# EAGLE design topboardcombined (EAGLE 9.6.2)
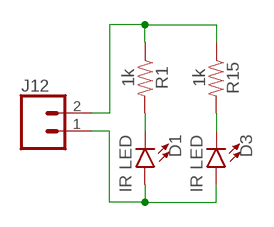
[diagram p0: schematic, sheet 1]

## Parts
D1  IR LED  LED-IR0603  [LED-0603]
D3  IR LED  LED-IR0603  [LED-0603]
J12  CONN_02  [1X02]
R1  1k  1KOHM-0603-1/10W-1%  [0603]
R15  1k  1KOHM-0603-1/10W-1%  [0603]

## Nets
N$44: J12.2 R1.1 R15.1
N$45: D1.C R1.2
N$46: D3.C R15.2
N$51: D1.A D3.A J12.1

## Library data of the parts
D1 D3 = SparkFun-LED:LED-IR: Infrared LED (IR) Wavelength: 940nm Packages: TSAL6100 LTE302 - Side firing. Check SparkFun-Sensors.lbr for the receiver SparkFun Products: ZX Distance and Gesture Sensor <[https://www.sparkfun.com/products/12780]> Infrared Emitters and Detectors <https://www.sparkfun.com/products/241>; PROD_ID: DIO-14125
J12 = SparkFun-Connectors:CONN_02: Multi connection point. Often used as Generic Header-pin footprint for 0.1 inch spaced/style header connections On any of the 0.1 inch spaced packages, you can populate with these: Break Away Headers - Straight <https://www.sparkfun.com/products/116> (PRT-00116) Break Away Male Headers - Right Angle <https://www.sparkfun.com/products/553> (PRT-00553) Female Headers <https://www.sparkfun.com/products/115> (PRT-00115) Break Away Headers - Machine Pin <https://www.sparkfun.com/products/117> (PRT-00117) Break Away Female Headers - Swiss Machine Pin <https://www.sparkfun.com/products/743> (PRT-00743) For SCREWTERMINALS and SPRING TERMINALS visit here: Screw Terimnals on SparkFun.com <https://www.sparkfun.com/search/results?term=Screw+Terminals> (5mm/3.5mm/2.54mm spacing) This device is also useful as a general connection point to wire up your design to another part of your project. Our various solder wires solder well into these plated through hole pads. Hook-Up Wire - Assortment (Stranded, 22 AWG) <https://www.sparkfun.com/products/11375> (PRT-11375) Hook-Up Wire - Assortment (Solid Core, 22 AWG) <https://www.sparkfun.com/products/11367> (PRT-11367) View the entire wire category on our website here <https://www.sparkfun.com/categories/141> Special notes: Molex polarized connector foot print use with: PRT-08233 with associated crimp pins and housings. 2.54_SCREWTERM for use with PRT-10571. 3.5mm Screw Terminal footprints for PRT-08084 5mm Screw Terminal footprints for use with PRT-08432
R1 R15 = SparkFun-Resistors:1KOHM: 1kΩ resistor A resistor is a passive two-terminal electrical component that implements electrical resistance as a circuit element. Resistors act to reduce current flow, and, at the same time, act to lower voltage levels within circuits. - Wikipedia; PROD_ID: RES-07856

## Board
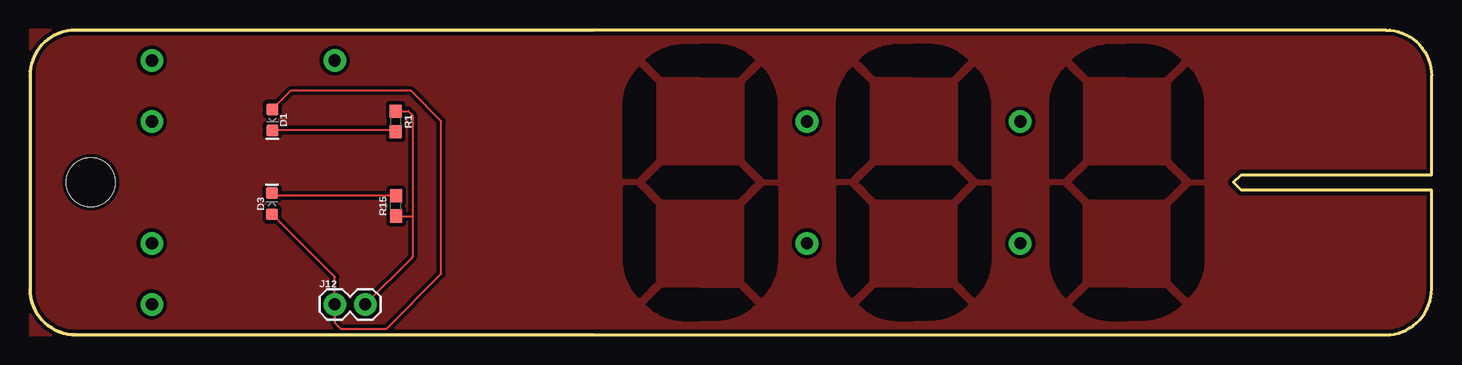
[diagram p1: board, top side]
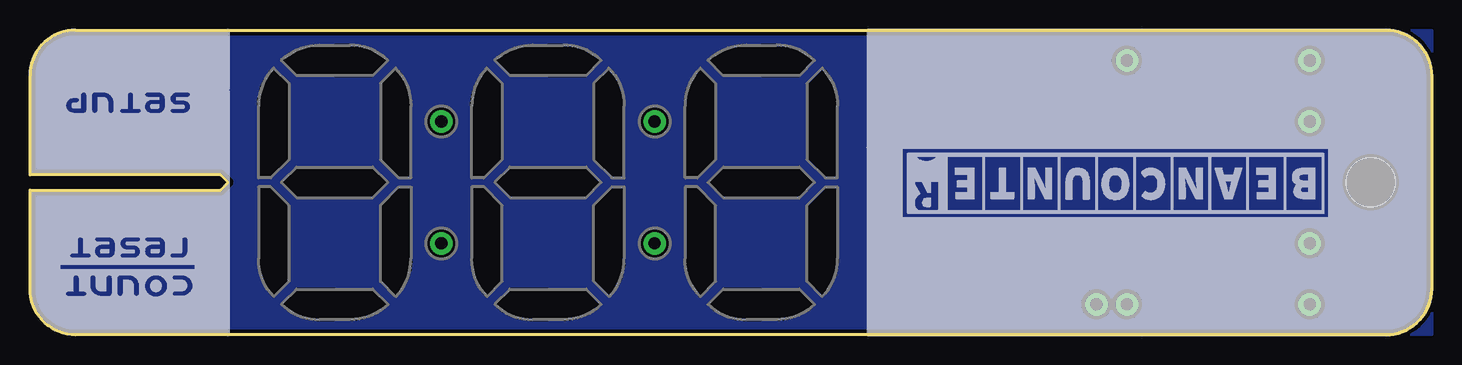
[diagram p2: board, bottom side, seen from below]

Size 116.84 x 25.4 mm. Coordinates in mm from the lower left corner, seen from the top.
Outline: 3.81,0 113.03,0 arc90 116.84,3.81 116.84,12.06 100.96,12.06 100.33,12.7 100.96,13.34 116.84,13.34 116.84,21.59 arc90 113.03,25.4 3.81,25.4
Outline: 3.81,0 arc-90 0,3.81
Outline: 3.81,25.4 arc90 0,21.59
Outline: 0,3.81 arc90 3.81,0
Outline: 24.13,0 46.99,0
Outline: 3.81,25.4 arc90 0,21.59
Outline: 0,21.59 0,3.81
Outline: 46.99,25.4 24.13,25.4
Copper layers (1*16): Top 0.035mm / dielectric 30mil / Bottom 0.035mm
Design rules "SparkFun-2-Layer-Minimum-JLCPCB *": minimum track width 5mil, minimum drill 0.3mm, track to track 5mil, track to pad 5mil, pad to pad 5mil, via to via 5mil, smd to smd 5mil, copper to edge 7mil, drill to drill 7mil, minimum pad ring 5mil, minimum via ring 5mil, stop-mask expansion 4mil, vias tented up to drill 25mil, thermal gap 10mil
Holes 4.06 mm at 5.08,12.7

### Footprints (pad centres in the part's own frame; a part is rotated, then mirrored left to right if it is on the bottom)
LED-0603 = smd 1 x 1: A -0.877,0; C 0.877,0
1X02 = drill 1.016 pad 1.88: 1 0,0; 2 2.54,0
0603 = smd 1.1 x 1: 1 -0.85,0; 2 0.85,0

### Placement (x,y rotation side)
D1  20.19,17.91 270 top
D3  20.18,10.92 90 top
J12  25.4,2.54 0 top
R1  30.48,17.78 270 top
R15  30.5,10.74 90 top
U$1  [#COUNT#0]  108.71,4.06 180 bottom
U$2  [#RESET#0]  108.71,7.24 180 bottom
U$3  [#SETUP#0]  108.71,19.3 180 bottom
U$4  [LOGO#SVG0]  8.89,15.24 180 bottom

### Tracks (layer width: path | path; a pad name or v marks a point on that pad's centre or on a via)
MASKBTM
  pour Top (isolate 0.305): 0,0 113.03,0 arc90 116.84,3.81 116.84,12.06 100.96,12.06 100.33,12.7 100.96,13.34 116.84,13.34 116.84,21.59 arc90 113.03,25.4 0,25.4
MASKTP
  pour Bottom (isolate 0.305): 0,0 113.03,0 arc90 116.84,3.81 116.84,12.06 100.96,12.06 100.33,12.7 100.96,13.34 116.84,13.34 116.84,21.59 arc90 113.03,25.4 0,25.4
N$1  (via drill 1.02 pad 1.88)
  other vias: 25.4,22.86
N$23  (via drill 1.02 pad 1.88)
  other vias: 27.94,2.54
N$24  (via drill 1.02 pad 1.88)
  other vias: 25.4,2.54
N$25  (via drill 1.02 pad 1.88)
  other vias: 25.4,22.86
N$26  (via drill 1.02 pad 1.88)
  other vias: 82.55,17.78
N$27  (via drill 1.02 pad 1.88)
  other vias: 82.55,7.62
N$28  (via drill 1.02 pad 1.88)
  other vias: 64.77,7.62
N$29  (via drill 1.02 pad 1.88)
  other vias: 64.77,17.78
N$37  (via drill 1.02 pad 1.88)
  other vias: 10.16,22.86
N$38  (via drill 1.02 pad 1.88)
  other vias: 10.16,2.54
N$39  (via drill 1.02 pad 1.88)
  other vias: 10.16,7.62
N$40  (via drill 1.02 pad 1.88)
  other vias: 10.16,17.78
N$43  (via drill 1.02 pad 1.88)
  other vias: 25.4,22.86
N$44
  Top 0.152: R1.1 31.53,18.63 31.88,18.29 31.88,9.91 | 31.88,9.91 31.88,6.48 J12.2 | R15.1 31.86,9.89 31.88,9.91
N$45
  Top 0.152: 30.38,17.03 D1.C
  Top 0.254: R1.2 30.38,17.03
N$46
  Top 0.152: R15.2 20.38,11.59 D3.C
N$51
  Top 0.152: D1.A 21.73,20.32 31.75,20.32 34.29,17.78 34.29,5.08 29.72,0.51 25.91,0.51 25.4,1.02 J12.1 25.4,4.82 D3.A
N$52
  cutout Top: 55.88,1.27 55.88,3.81 59.05,3.81 60.33,2.54 60.05,2.29 59.82,2.11 59.59,1.96 59.33,1.8 59.08,1.68 58.78,1.55 58.39,1.42 58.06,1.35 57.71,1.3 57.4,1.27
N$53
  cutout Top: 60.96,3.17 59.69,4.45 59.69,10.8 61.21,12.32 62.23,12.32 62.23,6.12 62.2,5.82 62.15,5.46 62.1,5.23 62.05,5.05 61.95,4.75 61.87,4.57 61.75,4.29 61.59,4.01 61.44,3.76 61.21,3.45
N$54
  cutout Top: 55.88,1.27 55.88,3.81 52.7,3.81 51.44,2.54 51.71,2.29 51.94,2.11 52.17,1.96 52.43,1.8 52.68,1.68 52.98,1.55 53.37,1.42 53.7,1.35 54.05,1.3 54.36,1.27
N$55
  cutout Top: 50.8,3.17 52.07,4.45 52.07,10.8 50.55,12.32 49.53,12.32 49.53,6.12 49.56,5.82 49.61,5.46 49.66,5.23 49.71,5.05 49.81,4.75 49.89,4.57 50.01,4.29 50.16,4.01 50.32,3.76 50.55,3.45
N$56
  cutout Top: 55.88,24.13 55.88,21.59 59.05,21.59 60.33,22.86 60.05,23.11 59.82,23.29 59.59,23.44 59.33,23.6 59.08,23.72 58.78,23.85 58.39,23.98 58.06,24.05 57.71,24.1 57.4,24.13
N$57
  cutout Top: 60.96,22.23 59.69,20.95 59.69,14.6 61.21,13.08 62.23,13.08 62.23,19.28 62.2,19.58 62.15,19.94 62.1,20.17 62.05,20.35 61.95,20.65 61.87,20.83 61.75,21.11 61.59,21.39 61.44,21.64 61.21,21.95
N$58
  cutout Top: 55.88,24.13 55.88,21.59 52.7,21.59 51.44,22.86 51.71,23.11 51.94,23.29 52.17,23.44 52.43,23.6 52.68,23.72 52.98,23.85 53.37,23.98 53.7,24.05 54.05,24.1 54.36,24.13
N$59
  cutout Top: 50.8,22.23 52.07,20.95 52.07,14.6 50.55,13.08 49.53,13.08 49.53,19.28 49.56,19.58 49.61,19.94 49.66,20.17 49.71,20.35 49.81,20.65 49.89,20.83 50.01,21.11 50.16,21.39 50.32,21.64 50.55,21.95
N$60
  cutout Top: 51.44,12.7 52.7,11.43 59.05,11.43 60.33,12.7 59.05,13.97 52.7,13.97
N$61
  cutout Bottom: 55.88,1.27 55.88,3.81 59.05,3.81 60.33,2.54 60.05,2.29 59.82,2.11 59.59,1.96 59.33,1.8 59.08,1.68 58.78,1.55 58.39,1.42 58.06,1.35 57.71,1.3 57.4,1.27
N$62
  cutout Bottom: 60.96,3.17 59.69,4.45 59.69,10.8 61.21,12.32 62.23,12.32 62.23,6.12 62.2,5.82 62.15,5.46 62.1,5.23 62.05,5.05 61.95,4.75 61.87,4.57 61.75,4.29 61.59,4.01 61.44,3.76 61.21,3.45
N$63
  cutout Bottom: 55.88,1.27 55.88,3.81 52.7,3.81 51.44,2.54 51.71,2.29 51.94,2.11 52.17,1.96 52.43,1.8 52.68,1.68 52.98,1.55 53.37,1.42 53.7,1.35 54.05,1.3 54.36,1.27
N$64
  cutout Bottom: 50.8,3.17 52.07,4.45 52.07,10.8 50.55,12.32 49.53,12.32 49.53,6.12 49.56,5.82 49.61,5.46 49.66,5.23 49.71,5.05 49.81,4.75 49.89,4.57 50.01,4.29 50.16,4.01 50.32,3.76 50.55,3.45
N$65
  cutout Bottom: 55.88,24.13 55.88,21.59 59.05,21.59 60.33,22.86 60.05,23.11 59.82,23.29 59.59,23.44 59.33,23.6 59.08,23.72 58.78,23.85 58.39,23.98 58.06,24.05 57.71,24.1 57.4,24.13
N$66
  cutout Bottom: 60.96,22.23 59.69,20.95 59.69,14.6 61.21,13.08 62.23,13.08 62.23,19.28 62.2,19.58 62.15,19.94 62.1,20.17 62.05,20.35 61.95,20.65 61.87,20.83 61.75,21.11 61.59,21.39 61.44,21.64 61.21,21.95
N$67
  cutout Bottom: 55.88,24.13 55.88,21.59 52.7,21.59 51.44,22.86 51.71,23.11 51.94,23.29 52.17,23.44 52.43,23.6 52.68,23.72 52.98,23.85 53.37,23.98 53.7,24.05 54.05,24.1 54.36,24.13
N$68
  cutout Bottom: 50.8,22.23 52.07,20.95 52.07,14.6 50.55,13.08 49.53,13.08 49.53,19.28 49.56,19.58 49.61,19.94 49.66,20.17 49.71,20.35 49.81,20.65 49.89,20.83 50.01,21.11 50.16,21.39 50.32,21.64 50.55,21.95
N$69
  cutout Bottom: 51.44,12.7 52.7,11.43 59.05,11.43 60.33,12.7 59.05,13.97 52.7,13.97
N$70
  cutout Top: 73.66,1.27 73.66,3.81 76.83,3.81 78.11,2.54 77.83,2.29 77.6,2.11 77.37,1.96 77.11,1.8 76.86,1.68 76.56,1.55 76.17,1.42 75.84,1.35 75.49,1.3 75.18,1.27
N$71
  cutout Top: 78.74,3.17 77.47,4.45 77.47,10.8 78.99,12.32 80.01,12.32 80.01,6.12 79.98,5.82 79.93,5.46 79.88,5.23 79.83,5.05 79.73,4.75 79.65,4.57 79.53,4.29 79.38,4.01 79.22,3.76 78.99,3.45
N$72
  cutout Top: 73.66,1.27 73.66,3.81 70.48,3.81 69.22,2.54 69.49,2.29 69.72,2.11 69.95,1.96 70.21,1.8 70.46,1.68 70.76,1.55 71.15,1.42 71.48,1.35 71.83,1.3 72.14,1.27
N$73
  cutout Top: 68.58,3.17 69.85,4.45 69.85,10.8 68.33,12.32 67.31,12.32 67.31,6.12 67.34,5.82 67.39,5.46 67.44,5.23 67.49,5.05 67.59,4.75 67.67,4.57 67.79,4.29 67.94,4.01 68.1,3.76 68.33,3.45
N$74
  cutout Top: 73.66,24.13 73.66,21.59 76.83,21.59 78.11,22.86 77.83,23.11 77.6,23.29 77.37,23.44 77.11,23.6 76.86,23.72 76.56,23.85 76.17,23.98 75.84,24.05 75.49,24.1 75.18,24.13
N$75
  cutout Top: 78.74,22.23 77.47,20.95 77.47,14.6 78.99,13.08 80.01,13.08 80.01,19.28 79.98,19.58 79.93,19.94 79.88,20.17 79.83,20.35 79.73,20.65 79.65,20.83 79.53,21.11 79.38,21.39 79.22,21.64 78.99,21.95
N$76
  cutout Top: 73.66,24.13 73.66,21.59 70.48,21.59 69.22,22.86 69.49,23.11 69.72,23.29 69.95,23.44 70.21,23.6 70.46,23.72 70.76,23.85 71.15,23.98 71.48,24.05 71.83,24.1 72.14,24.13
N$77
  cutout Top: 68.58,22.23 69.85,20.95 69.85,14.6 68.33,13.08 67.31,13.08 67.31,19.28 67.34,19.58 67.39,19.94 67.44,20.17 67.49,20.35 67.59,20.65 67.67,20.83 67.79,21.11 67.94,21.39 68.1,21.64 68.33,21.95
N$78
  cutout Top: 69.22,12.7 70.48,11.43 76.83,11.43 78.11,12.7 76.83,13.97 70.48,13.97
N$79
  cutout Bottom: 73.66,1.27 73.66,3.81 76.83,3.81 78.11,2.54 77.83,2.29 77.6,2.11 77.37,1.96 77.11,1.8 76.86,1.68 76.56,1.55 76.17,1.42 75.84,1.35 75.49,1.3 75.18,1.27
N$80
  cutout Bottom: 78.74,3.17 77.47,4.45 77.47,10.8 78.99,12.32 80.01,12.32 80.01,6.12 79.98,5.82 79.93,5.46 79.88,5.23 79.83,5.05 79.73,4.75 79.65,4.57 79.53,4.29 79.38,4.01 79.22,3.76 78.99,3.45
N$81
  cutout Bottom: 73.66,1.27 73.66,3.81 70.48,3.81 69.22,2.54 69.49,2.29 69.72,2.11 69.95,1.96 70.21,1.8 70.46,1.68 70.76,1.55 71.15,1.42 71.48,1.35 71.83,1.3 72.14,1.27
N$82
  cutout Bottom: 68.58,3.17 69.85,4.45 69.85,10.8 68.33,12.32 67.31,12.32 67.31,6.12 67.34,5.82 67.39,5.46 67.44,5.23 67.49,5.05 67.59,4.75 67.67,4.57 67.79,4.29 67.94,4.01 68.1,3.76 68.33,3.45
N$83
  cutout Bottom: 73.66,24.13 73.66,21.59 76.83,21.59 78.11,22.86 77.83,23.11 77.6,23.29 77.37,23.44 77.11,23.6 76.86,23.72 76.56,23.85 76.17,23.98 75.84,24.05 75.49,24.1 75.18,24.13
N$84
  cutout Bottom: 78.74,22.23 77.47,20.95 77.47,14.6 78.99,13.08 80.01,13.08 80.01,19.28 79.98,19.58 79.93,19.94 79.88,20.17 79.83,20.35 79.73,20.65 79.65,20.83 79.53,21.11 79.38,21.39 79.22,21.64 78.99,21.95
N$85
  cutout Bottom: 73.66,24.13 73.66,21.59 70.48,21.59 69.22,22.86 69.49,23.11 69.72,23.29 69.95,23.44 70.21,23.6 70.46,23.72 70.76,23.85 71.15,23.98 71.48,24.05 71.83,24.1 72.14,24.13
N$86
  cutout Bottom: 68.58,22.23 69.85,20.95 69.85,14.6 68.33,13.08 67.31,13.08 67.31,19.28 67.34,19.58 67.39,19.94 67.44,20.17 67.49,20.35 67.59,20.65 67.67,20.83 67.79,21.11 67.94,21.39 68.1,21.64 68.33,21.95
N$87
  cutout Bottom: 69.22,12.7 70.48,11.43 76.83,11.43 78.11,12.7 76.83,13.97 70.48,13.97
N$88
  cutout Top: 91.44,1.27 91.44,3.81 94.61,3.81 95.89,2.54 95.61,2.29 95.38,2.11 95.15,1.96 94.89,1.8 94.64,1.68 94.34,1.55 93.95,1.42 93.62,1.35 93.27,1.3 92.96,1.27
N$89
  cutout Top: 96.52,3.17 95.25,4.45 95.25,10.8 96.77,12.32 97.79,12.32 97.79,6.12 97.76,5.82 97.71,5.46 97.66,5.23 97.61,5.05 97.51,4.75 97.43,4.57 97.31,4.29 97.15,4.01 97,3.76 96.77,3.45
N$90
  cutout Top: 91.44,1.27 91.44,3.81 88.27,3.81 86.99,2.54 87.27,2.29 87.5,2.11 87.73,1.96 87.99,1.8 88.24,1.68 88.54,1.55 88.93,1.42 89.26,1.35 89.61,1.3 89.92,1.27
N$91
  cutout Top: 86.36,3.17 87.63,4.45 87.63,10.8 86.11,12.32 85.09,12.32 85.09,6.12 85.12,5.82 85.17,5.46 85.22,5.23 85.27,5.05 85.37,4.75 85.45,4.57 85.57,4.29 85.73,4.01 85.88,3.76 86.11,3.45
N$92
  cutout Top: 91.44,24.13 91.44,21.59 94.61,21.59 95.89,22.86 95.61,23.11 95.38,23.29 95.15,23.44 94.89,23.6 94.64,23.72 94.34,23.85 93.95,23.98 93.62,24.05 93.27,24.1 92.96,24.13
N$93
  cutout Top: 96.52,22.23 95.25,20.95 95.25,14.6 96.77,13.08 97.79,13.08 97.79,19.28 97.76,19.58 97.71,19.94 97.66,20.17 97.61,20.35 97.51,20.65 97.43,20.83 97.31,21.11 97.15,21.39 97,21.64 96.77,21.95
N$94
  cutout Top: 91.44,24.13 91.44,21.59 88.27,21.59 86.99,22.86 87.27,23.11 87.5,23.29 87.73,23.44 87.99,23.6 88.24,23.72 88.54,23.85 88.93,23.98 89.26,24.05 89.61,24.1 89.92,24.13
N$95
  cutout Top: 86.36,22.23 87.63,20.95 87.63,14.6 86.11,13.08 85.09,13.08 85.09,19.28 85.12,19.58 85.17,19.94 85.22,20.17 85.27,20.35 85.37,20.65 85.45,20.83 85.57,21.11 85.73,21.39 85.88,21.64 86.11,21.95
N$96
  cutout Top: 86.99,12.7 88.27,11.43 94.61,11.43 95.89,12.7 94.61,13.97 88.27,13.97
N$97
  cutout Bottom: 91.44,1.27 91.44,3.81 94.61,3.81 95.89,2.54 95.61,2.29 95.38,2.11 95.15,1.96 94.89,1.8 94.64,1.68 94.34,1.55 93.95,1.42 93.62,1.35 93.27,1.3 92.96,1.27
N$98
  cutout Bottom: 96.52,3.17 95.25,4.45 95.25,10.8 96.77,12.32 97.79,12.32 97.79,6.12 97.76,5.82 97.71,5.46 97.66,5.23 97.61,5.05 97.51,4.75 97.43,4.57 97.31,4.29 97.15,4.01 97,3.76 96.77,3.45
N$99
  cutout Bottom: 91.44,1.27 91.44,3.81 88.27,3.81 86.99,2.54 87.27,2.29 87.5,2.11 87.73,1.96 87.99,1.8 88.24,1.68 88.54,1.55 88.93,1.42 89.26,1.35 89.61,1.3 89.92,1.27
N$100
  cutout Bottom: 86.36,3.17 87.63,4.45 87.63,10.8 86.11,12.32 85.09,12.32 85.09,6.12 85.12,5.82 85.17,5.46 85.22,5.23 85.27,5.05 85.37,4.75 85.45,4.57 85.57,4.29 85.73,4.01 85.88,3.76 86.11,3.45
N$101
  cutout Bottom: 91.44,24.13 91.44,21.59 94.61,21.59 95.89,22.86 95.61,23.11 95.38,23.29 95.15,23.44 94.89,23.6 94.64,23.72 94.34,23.85 93.95,23.98 93.62,24.05 93.27,24.1 92.96,24.13
N$102
  cutout Bottom: 96.52,22.23 95.25,20.95 95.25,14.6 96.77,13.08 97.79,13.08 97.79,19.28 97.76,19.58 97.71,19.94 97.66,20.17 97.61,20.35 97.51,20.65 97.43,20.83 97.31,21.11 97.15,21.39 97,21.64 96.77,21.95
N$103
  cutout Bottom: 91.44,24.13 91.44,21.59 88.27,21.59 86.99,22.86 87.27,23.11 87.5,23.29 87.73,23.44 87.99,23.6 88.24,23.72 88.54,23.85 88.93,23.98 89.26,24.05 89.61,24.1 89.92,24.13
N$104
  cutout Bottom: 86.36,22.23 87.63,20.95 87.63,14.6 86.11,13.08 85.09,13.08 85.09,19.28 85.12,19.58 85.17,19.94 85.22,20.17 85.27,20.35 85.37,20.65 85.45,20.83 85.57,21.11 85.73,21.39 85.88,21.64 86.11,21.95
N$105
  cutout Bottom: 86.99,12.7 88.27,11.43 94.61,11.43 95.89,12.7 94.61,13.97 88.27,13.97